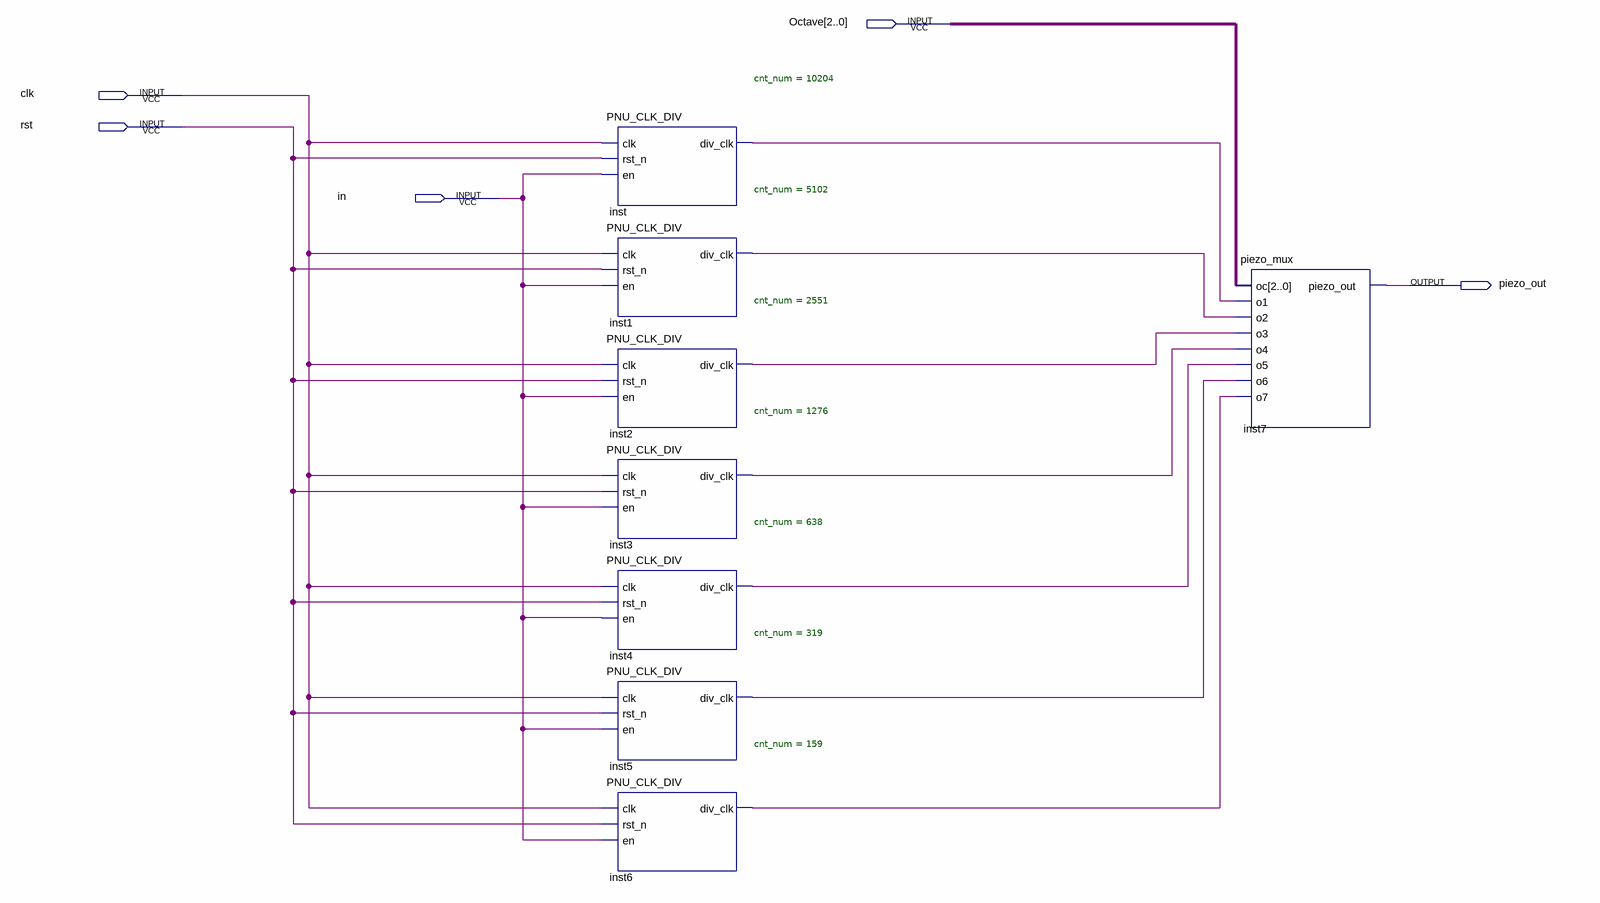
[diagram p0: schematic sheet]
// Quartus schematic G.bdf as structural Verilog: 8 symbols, 5 pins
module G (
  input  [2:0] Octave,
  input  clk,
  input  rst,
  input  in,
  output piezo_out
);

  wire inst1_div_clk, inst2_div_clk, inst3_div_clk, inst4_div_clk, inst5_div_clk, inst6_div_clk, inst_div_clk;

  PNU_CLK_DIV #(.cnt_num(10204)) inst (.clk(clk), .rst_n(rst), .en(in), .div_clk(inst_div_clk));
  PNU_CLK_DIV #(.cnt_num(5102)) inst1 (.clk(clk), .rst_n(rst), .en(in), .div_clk(inst1_div_clk));
  PNU_CLK_DIV #(.cnt_num(2551)) inst2 (.clk(clk), .rst_n(rst), .en(in), .div_clk(inst2_div_clk));
  PNU_CLK_DIV #(.cnt_num(1276)) inst3 (.clk(clk), .rst_n(rst), .en(in), .div_clk(inst3_div_clk));
  PNU_CLK_DIV #(.cnt_num(638)) inst4 (.clk(clk), .rst_n(rst), .en(in), .div_clk(inst4_div_clk));
  PNU_CLK_DIV #(.cnt_num(319)) inst5 (.clk(clk), .rst_n(rst), .en(in), .div_clk(inst5_div_clk));
  PNU_CLK_DIV #(.cnt_num(159)) inst6 (.clk(clk), .rst_n(rst), .en(in), .div_clk(inst6_div_clk));
  piezo_mux inst7 (
    .oc(Octave), .o1(inst_div_clk), .o2(inst1_div_clk), .o3(inst2_div_clk), .o4(inst3_div_clk),
    .o5(inst4_div_clk), .o6(inst5_div_clk), .o7(inst6_div_clk), .piezo_out(piezo_out));
endmodule
